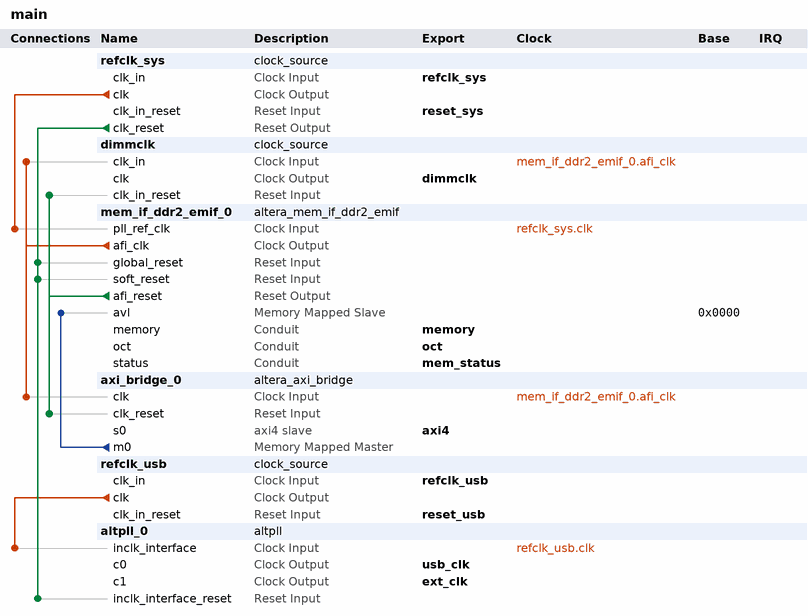
[diagram p0: system contents]
# Platform Designer (Qsys) system main, Stratix IV EP4SGX230KF40C2
# Parameters at their usual value, and those the tool derives, are not listed.
package require -exact qsys 18.1
create_system main
set_project_property DEVICE_FAMILY {Stratix IV}
set_project_property DEVICE EP4SGX230KF40C2

add_instance refclk_sys clock_source 18.1
set_instance_parameter_value refclk_sys clockFrequency 50000000

add_instance dimmclk clock_source 18.1
set_instance_parameter_value dimmclk clockFrequency 100000000

add_instance mem_if_ddr2_emif_0 altera_mem_if_ddr2_emif 18.1
set_instance_parameter_value mem_if_ddr2_emif_0 AVL_MAX_SIZE 8
set_instance_parameter_value mem_if_ddr2_emif_0 CALIBRATION_MODE Skip
set_instance_parameter_value mem_if_ddr2_emif_0 DLL_SHARING_MODE None
set_instance_parameter_value mem_if_ddr2_emif_0 EXPORT_AFI_HALF_CLK false
set_instance_parameter_value mem_if_ddr2_emif_0 MEM_BANKADDR_WIDTH 3
set_instance_parameter_value mem_if_ddr2_emif_0 MEM_CLK_FREQ 200.0
set_instance_parameter_value mem_if_ddr2_emif_0 MEM_COL_ADDR_WIDTH 10
set_instance_parameter_value mem_if_ddr2_emif_0 MEM_DQ_WIDTH 64
set_instance_parameter_value mem_if_ddr2_emif_0 MEM_NUMBER_OF_RANKS_PER_DIMM 1
set_instance_parameter_value mem_if_ddr2_emif_0 MEM_ROW_ADDR_WIDTH 14
set_instance_parameter_value mem_if_ddr2_emif_0 MEM_TCL 6
set_instance_parameter_value mem_if_ddr2_emif_0 MEM_TFAW_NS 35.0
set_instance_parameter_value mem_if_ddr2_emif_0 MEM_TMRD_CK 2
set_instance_parameter_value mem_if_ddr2_emif_0 MEM_TRAS_NS 45.0
set_instance_parameter_value mem_if_ddr2_emif_0 MEM_TRFC_NS 105.0
set_instance_parameter_value mem_if_ddr2_emif_0 MEM_VENDOR JEDEC
set_instance_parameter_value mem_if_ddr2_emif_0 PLL_SHARING_MODE None
set_instance_parameter_value mem_if_ddr2_emif_0 POWER_OF_TWO_BUS false
set_instance_parameter_value mem_if_ddr2_emif_0 REF_CLK_FREQ 50.0
set_instance_parameter_value mem_if_ddr2_emif_0 TIMING_TDH 125
set_instance_parameter_value mem_if_ddr2_emif_0 TIMING_TDQSQ 240
set_instance_parameter_value mem_if_ddr2_emif_0 TIMING_TDS 50
set_instance_parameter_value mem_if_ddr2_emif_0 TIMING_TIH 250
set_instance_parameter_value mem_if_ddr2_emif_0 TIMING_TIS 175
set_instance_parameter_value mem_if_ddr2_emif_0 TIMING_TQHS 300
set_instance_parameter_value mem_if_ddr2_emif_0 USER_DEBUG_LEVEL 1

add_instance axi_bridge_0 altera_axi_bridge 18.1
set_instance_parameter_value axi_bridge_0 ADDR_WIDTH 32
set_instance_parameter_value axi_bridge_0 AXI_VERSION AXI4
set_instance_parameter_value axi_bridge_0 COMBINED_ACCEPTANCE_CAPABILITY 16
set_instance_parameter_value axi_bridge_0 COMBINED_ISSUING_CAPABILITY 16
set_instance_parameter_value axi_bridge_0 DATA_WIDTH 32
set_instance_parameter_value axi_bridge_0 M0_ID_WIDTH 4
set_instance_parameter_value axi_bridge_0 READ_ACCEPTANCE_CAPABILITY 16
set_instance_parameter_value axi_bridge_0 READ_ADDR_USER_WIDTH 64
set_instance_parameter_value axi_bridge_0 READ_DATA_REORDERING_DEPTH 1
set_instance_parameter_value axi_bridge_0 READ_DATA_USER_WIDTH 64
set_instance_parameter_value axi_bridge_0 READ_ISSUING_CAPABILITY 16
set_instance_parameter_value axi_bridge_0 S0_ID_WIDTH 4
set_instance_parameter_value axi_bridge_0 USE_M0_ARBURST 1
set_instance_parameter_value axi_bridge_0 USE_M0_ARCACHE 1
set_instance_parameter_value axi_bridge_0 USE_M0_ARID 1
set_instance_parameter_value axi_bridge_0 USE_M0_ARLEN 1
set_instance_parameter_value axi_bridge_0 USE_M0_ARLOCK 1
set_instance_parameter_value axi_bridge_0 USE_M0_ARQOS 1
set_instance_parameter_value axi_bridge_0 USE_M0_ARREGION 0
set_instance_parameter_value axi_bridge_0 USE_M0_ARSIZE 1
set_instance_parameter_value axi_bridge_0 USE_M0_ARUSER 0
set_instance_parameter_value axi_bridge_0 USE_M0_AWBURST 1
set_instance_parameter_value axi_bridge_0 USE_M0_AWCACHE 1
set_instance_parameter_value axi_bridge_0 USE_M0_AWID 1
set_instance_parameter_value axi_bridge_0 USE_M0_AWLEN 1
set_instance_parameter_value axi_bridge_0 USE_M0_AWLOCK 1
set_instance_parameter_value axi_bridge_0 USE_M0_AWQOS 1
set_instance_parameter_value axi_bridge_0 USE_M0_AWREGION 0
set_instance_parameter_value axi_bridge_0 USE_M0_AWSIZE 1
set_instance_parameter_value axi_bridge_0 USE_M0_AWUSER 0
set_instance_parameter_value axi_bridge_0 USE_M0_BID 1
set_instance_parameter_value axi_bridge_0 USE_M0_BRESP 1
set_instance_parameter_value axi_bridge_0 USE_M0_BUSER 0
set_instance_parameter_value axi_bridge_0 USE_M0_RID 1
set_instance_parameter_value axi_bridge_0 USE_M0_RLAST 1
set_instance_parameter_value axi_bridge_0 USE_M0_RRESP 1
set_instance_parameter_value axi_bridge_0 USE_M0_RUSER 0
set_instance_parameter_value axi_bridge_0 USE_M0_WSTRB 1
set_instance_parameter_value axi_bridge_0 USE_M0_WUSER 0
set_instance_parameter_value axi_bridge_0 USE_PIPELINE 1
set_instance_parameter_value axi_bridge_0 USE_S0_ARCACHE 1
set_instance_parameter_value axi_bridge_0 USE_S0_ARLOCK 1
set_instance_parameter_value axi_bridge_0 USE_S0_ARPROT 1
set_instance_parameter_value axi_bridge_0 USE_S0_ARQOS 1
set_instance_parameter_value axi_bridge_0 USE_S0_ARREGION 0
set_instance_parameter_value axi_bridge_0 USE_S0_ARUSER 0
set_instance_parameter_value axi_bridge_0 USE_S0_AWCACHE 1
set_instance_parameter_value axi_bridge_0 USE_S0_AWLOCK 1
set_instance_parameter_value axi_bridge_0 USE_S0_AWPROT 1
set_instance_parameter_value axi_bridge_0 USE_S0_AWQOS 1
set_instance_parameter_value axi_bridge_0 USE_S0_AWREGION 0
set_instance_parameter_value axi_bridge_0 USE_S0_AWUSER 0
set_instance_parameter_value axi_bridge_0 USE_S0_BRESP 1
set_instance_parameter_value axi_bridge_0 USE_S0_BUSER 0
set_instance_parameter_value axi_bridge_0 USE_S0_RRESP 1
set_instance_parameter_value axi_bridge_0 USE_S0_RUSER 0
set_instance_parameter_value axi_bridge_0 USE_S0_WLAST 1
set_instance_parameter_value axi_bridge_0 USE_S0_WUSER 0
set_instance_parameter_value axi_bridge_0 WRITE_ACCEPTANCE_CAPABILITY 16
set_instance_parameter_value axi_bridge_0 WRITE_ADDR_USER_WIDTH 64
set_instance_parameter_value axi_bridge_0 WRITE_DATA_USER_WIDTH 64
set_instance_parameter_value axi_bridge_0 WRITE_ISSUING_CAPABILITY 16
set_instance_parameter_value axi_bridge_0 WRITE_RESP_USER_WIDTH 64

add_instance refclk_usb clock_source 18.1
set_instance_parameter_value refclk_usb clockFrequency 50000000

add_instance altpll_0 altpll 18.1
set_instance_parameter_value altpll_0 CLK0_DIVIDE_BY 25
set_instance_parameter_value altpll_0 CLK0_MULTIPLY_BY 24
set_instance_parameter_value altpll_0 CLK1_DIVIDE_BY 5
set_instance_parameter_value altpll_0 CLK1_DUTY_CYCLE 50
set_instance_parameter_value altpll_0 CLK1_MULTIPLY_BY 1
set_instance_parameter_value altpll_0 CLK1_PHASE_SHIFT 0
set_instance_parameter_value altpll_0 INCLK0_INPUT_FREQUENCY 20000
set_instance_parameter_value altpll_0 PORT_ARESET PORT_UNUSED
set_instance_parameter_value altpll_0 PORT_FBOUT PORT_UNUSED
set_instance_parameter_value altpll_0 PORT_LOCKED PORT_UNUSED
set_instance_parameter_value altpll_0 PORT_clk1 PORT_USED
set_instance_parameter_value altpll_0 PORT_clk2 PORT_UNUSED
set_instance_parameter_value altpll_0 PORT_clk3 PORT_UNUSED
set_instance_parameter_value altpll_0 PORT_clk6 PORT_UNUSED
set_instance_parameter_value altpll_0 PORT_clk7 PORT_UNUSED
set_instance_parameter_value altpll_0 PORT_clk8 PORT_UNUSED
set_instance_parameter_value altpll_0 PORT_clk9 PORT_UNUSED
set_instance_parameter_value altpll_0 USING_FBMIMICBIDIR_PORT OFF
set_instance_parameter_value altpll_0 WIDTH_CLOCK 10

# connections
add_connection mem_if_ddr2_emif_0.afi_clk axi_bridge_0.clk clock
add_connection mem_if_ddr2_emif_0.afi_clk dimmclk.clk_in clock
add_connection refclk_sys.clk mem_if_ddr2_emif_0.pll_ref_clk clock
add_connection refclk_usb.clk altpll_0.inclk_interface clock
add_connection mem_if_ddr2_emif_0.afi_reset axi_bridge_0.clk_reset reset
add_connection mem_if_ddr2_emif_0.afi_reset dimmclk.clk_in_reset reset
add_connection refclk_sys.clk_reset altpll_0.inclk_interface_reset reset
add_connection refclk_sys.clk_reset mem_if_ddr2_emif_0.global_reset reset
add_connection refclk_sys.clk_reset mem_if_ddr2_emif_0.soft_reset reset
add_connection axi_bridge_0.m0 mem_if_ddr2_emif_0.avl avalon
set_connection_parameter_value axi_bridge_0.m0/mem_if_ddr2_emif_0.avl baseAddress 0x0000

# exported interfaces
add_interface axi4 axi4 slave
set_interface_property axi4 EXPORT_OF axi_bridge_0.s0
add_interface dimmclk clock source
set_interface_property dimmclk EXPORT_OF dimmclk.clk
add_interface ext_clk clock source
set_interface_property ext_clk EXPORT_OF altpll_0.c1
add_interface mem_status conduit end
set_interface_property mem_status EXPORT_OF mem_if_ddr2_emif_0.status
add_interface memory conduit end
set_interface_property memory EXPORT_OF mem_if_ddr2_emif_0.memory
add_interface oct conduit end
set_interface_property oct EXPORT_OF mem_if_ddr2_emif_0.oct
add_interface refclk_sys clock sink
set_interface_property refclk_sys EXPORT_OF refclk_sys.clk_in
add_interface refclk_usb clock sink
set_interface_property refclk_usb EXPORT_OF refclk_usb.clk_in
add_interface reset_sys reset sink
set_interface_property reset_sys EXPORT_OF refclk_sys.clk_in_reset
add_interface reset_usb reset sink
set_interface_property reset_usb EXPORT_OF refclk_usb.clk_in_reset
add_interface usb_clk clock source
set_interface_property usb_clk EXPORT_OF altpll_0.c0

set_interconnect_requirement {$system} qsys_mm.clockCrossingAdapter HANDSHAKE
set_interconnect_requirement {$system} qsys_mm.enableEccProtection FALSE
set_interconnect_requirement {$system} qsys_mm.insertDefaultSlave FALSE
set_interconnect_requirement {$system} qsys_mm.maxAdditionalLatency 1

save_system main.qsys
